# Altium project Keyboard_Second_RevPrjPcb.PrjPcb
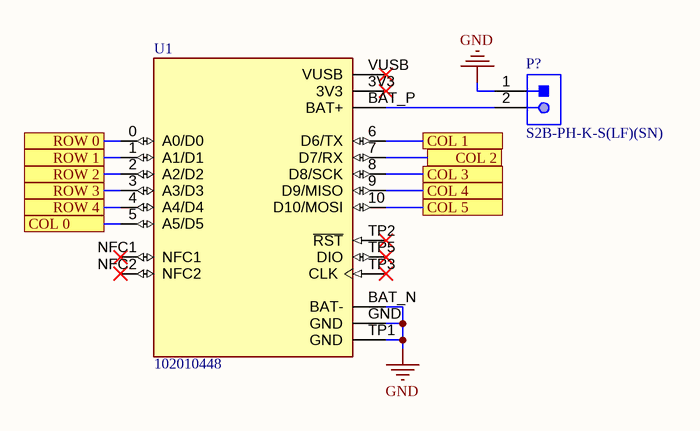
[diagram p0: NRF52840.SchDoc]
CAGE_CODE: ?????; CONTRACT_NUMBER: <CONTRACT NO>; DOC_NO_ASSY_DWG: <ASSY DWG NO>; DOC_NO_BOM: <BOM DOC NO>; DOC_NO_FAB_DWG: <FAB DWG NO>; DOC_NO_SCH_DWG: <SCH DWG NO>; PCB_2_DEC_TOL: +/-.01; PCB_3_DEC_TOL: +/-.010; PCB_ANG_TOL: +/-1/2; PCB_ASSEMBLY_NO: <PCB ASSY NO>; PCB_CHECKER: - -----; PCB_CHECKER_APP_DATE: --/--/----; PCB_DESIGNER: - -----; PCB_DESIGNER_APP_DATE: --/--/----; PCB_DWG_NO: <PCB DWG NO>; PCB_ENGINEER: - -----; PCB_ENGINEER_APP_DATE: --/--/----; PCB_PART_NUMBER: <PCB PN>; PCB_REV: A; SCH_REV: A
2 sheets, 68 parts. Net scope: flat (ports and power ports of the same name join across sheets).
Board file: Motherboard Reversible.PcbDoc
Sheets:
  NRF52840.SchDoc
  Switches.SchDoc

## Sheet NRF52840.SchDoc
size 431 x 279 mm; SheetNumber: 1; SheetTotal: 2; ENG_APP_DATE: --/--/--; DSN_APP_DATE: --/--/--; CHK_APP_DATE: --/--/--

### Parts
P?  S2B-PH-K-S(LF)(SN)  [JST-S2B-PH-K-S_V]
U1  102010448  [MODULE_102010448]

### Ports
COL 0, COL 1, COL 2, COL 3, COL 4, COL 5, ROW 0, ROW 1, ROW 2, ROW 3, ROW 4

### Nets
GND: P?.1 U1.BAT_N(BAT-) U1.GND U1.TP1(GND)
NetD1_1: U1.5(A5/D5) ; port COL 0
NetD2_1: U1.6(D6/TX) ; port COL 1
NetD3_1: U1.7(D7/RX) ; port COL 2
NetD4_1: U1.8(D8/SCK) ; port COL 3
NetD5_1: U1.9(D9/MISO) ; port COL 4
NetD22_1: U1.10(D10/MOSI) ; port COL 5
NetP?_2: P?.2 U1.BAT_P(BAT+)
NetS1_2: U1.0(A0/D0) ; port ROW 0
NetS6_2: U1.1(A1/D1) ; port ROW 1
NetS11_2: U1.2(A2/D2) ; port ROW 2
NetS16_2: U1.3(A3/D3) ; port ROW 3
NetS21_2: U1.4(A4/D4) ; port ROW 4

Not connected (* = marked no-connect by the designer): U1 3V3* NFC1* NFC2* TP2(~{RST})* TP3(CLK)* TP5(DIO)* VUSB*

### Notes on the sheet
- DWG. NO.
- REV.
- SHT.
- THIS DOCUMENT AND THE DATA DISCLOSED HEREIN OR HEREWITH IS THE PROPERTY OF ALTIUM LIMITED AND MAY BE FREELY DISTRIBUTED IN WHOLE. NO RIGHTS ARE RESERVED OR EXPRESS OR IMPLIED WARANTEE GIVEN.
- REVISION
- DESCRIPTION
- DATE
- APPROVED
- ENG:
- APPROVALS
- PROJECT
- DSN:
- CHK:
- REFERENCE DOCUMENTS
- PROJECT REVISION:
- TITLE
- DOCUMENT REVISION:
- DESIGN ITEM:
- BOM:
- FAB DWG:
- PCB DWG:
- ASSY DWG:
- SCALE:
- SIZE
- B
- CAGE CODE
- FILE NAME
- DWG NO.
- SHEET
- OF
- REV

### Library data of the parts
P? = CMP-1755-00004-1: Male Header, Pitch 2 mm, 1 x 2 Position, Height 4.8 mm, Tail Length 3.4 mm, -25 to 85 degC, RoHS, Bulk; Case\Package: Radial; Tolerance: 20%; Capacitance: 10 uF; Voltage Rating (DC): 50 V; Packaging: Bulk; ComponentLink1URL: http://www.jst-mfg.com/product/pdf/eng/ePH.pdf; Radiation Hardening: No; Height: 11 mm; Package Quantity: 200; PackageDescription: Male Header, Pitch 2 mm, 1 x 2 Position, Height 4.8 mm, Tail Length 3.4 mm; PackageReference: S2B-PH-K-S; Diameter: 5 mm; Pins: 2; Mount: Through Hole; Max Operating Temperature: 85 degC; Min Operating Temperature: -40 degC; ComponentLink1Description: Datasheet; DatasheetVersion: Dec-12; Length: 11 mm; Lead Pitch: 2 mm; REACH SVHC: No SVHC; Voltage Rating: 50 V; RoHSCompliant: true
U1 = 102010448: - nRF52840 Transceiver; Bluetooth® 5.x Evaluation Board; MF: Seeed Technology Co., Ltd; SnapEDA_Link: https://www.snapeda.com/parts/102010448/Seeed+Technology+Co.%252C+Ltd/view-part/?ref=snap; Package: None; Value: *; MP: 102010448; Check_prices: https://www.snapeda.com/parts/102010448/Seeed+Technology+Co.%252C+Ltd/view-part/?ref=eda

## Sheet Switches.SchDoc
size A3; SheetNumber: 2; SheetTotal: 2
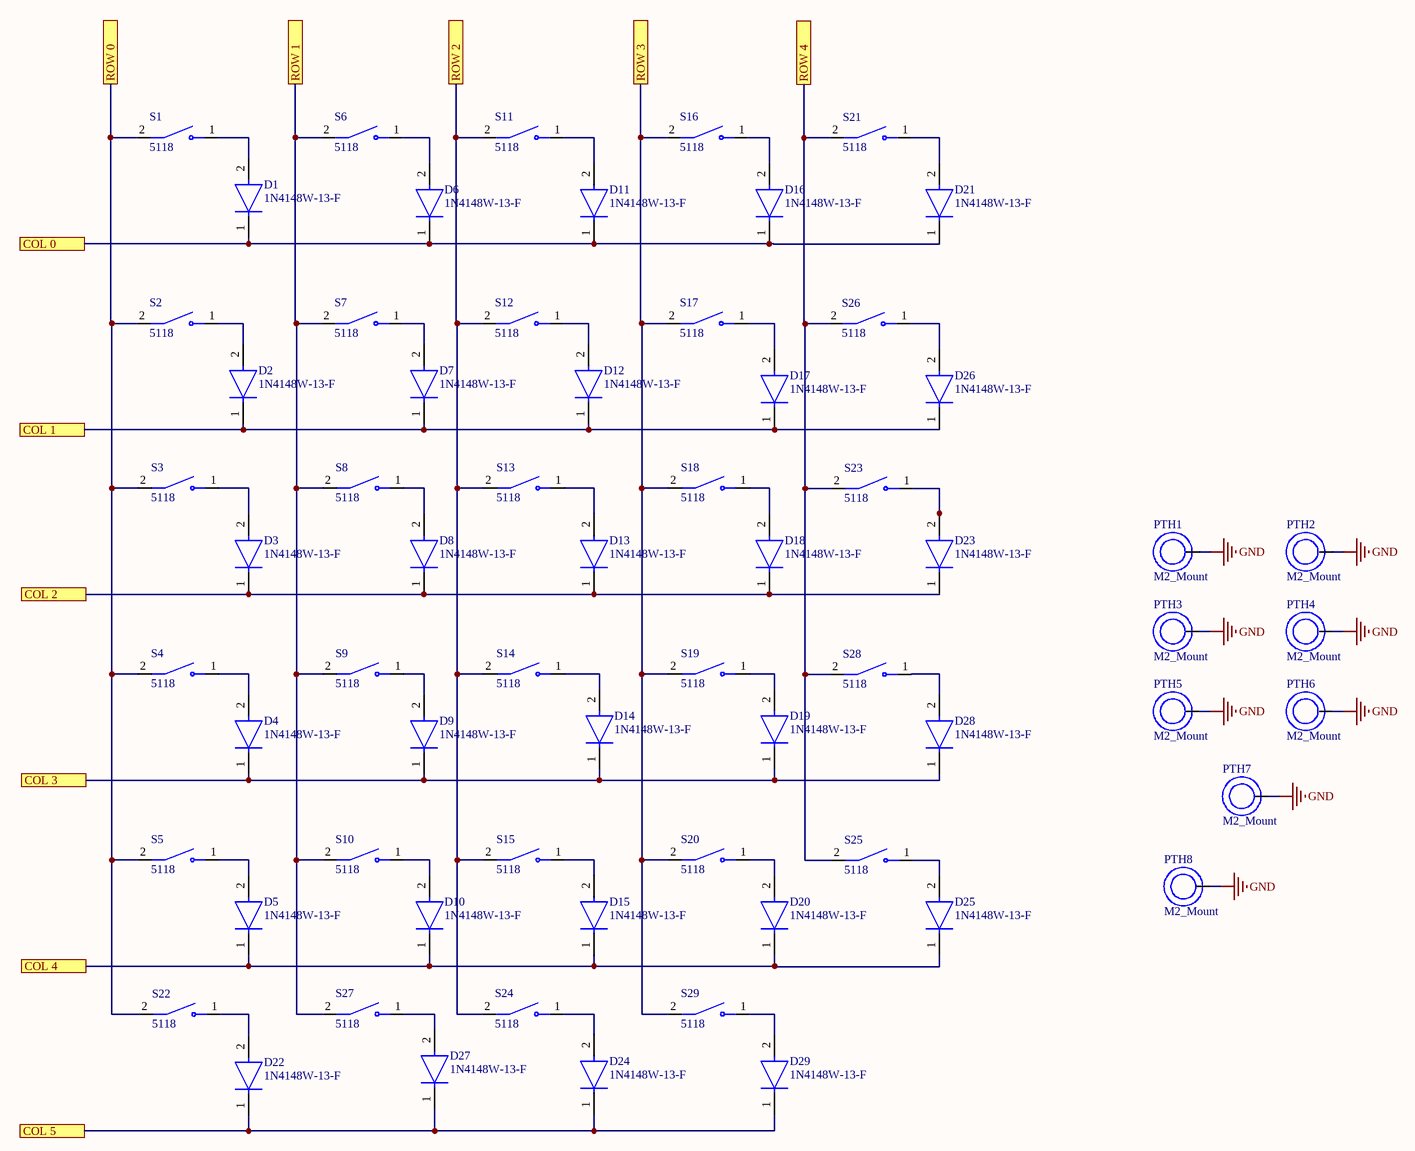
[diagram p1: Switches.SchDoc]

### Parts
D1  1N4148W-13-F  [FP-SOD123-MFG]
D2  1N4148W-13-F  [FP-SOD123-MFG]
D3  1N4148W-13-F  [FP-SOD123-MFG]
D4  1N4148W-13-F  [FP-SOD123-MFG]
D5  1N4148W-13-F  [FP-SOD123-MFG]
D6  1N4148W-13-F  [FP-SOD123-MFG]
D7  1N4148W-13-F  [FP-SOD123-MFG]
D8  1N4148W-13-F  [FP-SOD123-MFG]
D9  1N4148W-13-F  [FP-SOD123-MFG]
D10  1N4148W-13-F  [FP-SOD123-MFG]
D11  1N4148W-13-F  [FP-SOD123-MFG]
D12  1N4148W-13-F  [FP-SOD123-MFG]
D13  1N4148W-13-F  [FP-SOD123-MFG]
D14  1N4148W-13-F  [FP-SOD123-MFG]
D15  1N4148W-13-F  [FP-SOD123-MFG]
D16  1N4148W-13-F  [FP-SOD123-MFG]
D17  1N4148W-13-F  [FP-SOD123-MFG]
D18  1N4148W-13-F  [FP-SOD123-MFG]
D19  1N4148W-13-F  [FP-SOD123-MFG]
D20  1N4148W-13-F  [FP-SOD123-MFG]
D21  1N4148W-13-F  [FP-SOD123-MFG]
D22  1N4148W-13-F  [FP-SOD123-MFG]
D23  1N4148W-13-F  [FP-SOD123-MFG]
D24  1N4148W-13-F  [FP-SOD123-MFG]
D25  1N4148W-13-F  [FP-SOD123-MFG]
D26  1N4148W-13-F  [FP-SOD123-MFG]
D27  1N4148W-13-F  [FP-SOD123-MFG]
D28  1N4148W-13-F  [FP-SOD123-MFG]
D29  1N4148W-13-F  [FP-SOD123-MFG]
PTH1  M2_Mount  [Mounting_Holes]
PTH2  M2_Mount  [Mounting_Holes]
PTH3  M2_Mount  [Mounting_Holes]
PTH4  M2_Mount  [Mounting_Holes]
PTH5  M2_Mount  [Mounting_Holes]
PTH6  M2_Mount  [Mounting_Holes]
PTH7  M2_Mount  [Mounting_Holes]
PTH8  M2_Mount  [Mounting_Holes]
S1  5118  [SW_5118]
S2  5118  [SW_5118]
S3  5118  [SW_5118]
S4  5118  [SW_5118]
S5  5118  [SW_5118]
S6  5118  [SW_5118]
S7  5118  [SW_5118]
S8  5118  [SW_5118]
S9  5118  [SW_5118]
S10  5118  [SW_5118]
S11  5118  [SW_5118]
S12  5118  [SW_5118]
S13  5118  [SW_5118]
S14  5118  [SW_5118]
S15  5118  [SW_5118]
S16  5118  [SW_5118]
S17  5118  [SW_5118]
S18  5118  [SW_5118]
S19  5118  [SW_5118]
S20  5118  [SW_5118]
S21  5118  [SW_5118]
S22  5118  [SW_5118]
S23  5118  [SW_5118]
S24  5118  [SW_5118]
S25  5118  [SW_5118]
S26  5118  [SW_5118]
S27  5118  [SW_5118]
S28  5118  [SW_5118]
S29  5118  [SW_5118]

### Ports
COL 0, COL 1, COL 2, COL 3, COL 4, COL 5, ROW 0, ROW 1, ROW 2, ROW 3, ROW 4

### Nets
GND: PTH1.0 PTH2.0 PTH3.0 PTH4.0 PTH5.0 PTH6.0 PTH7.0 PTH8.0
NetD1_1: D1.1(C) D6.1(C) D11.1(C) D16.1(C) D21.1(C) ; port COL 0
NetD1_2: D1.2(A) S1.1(NO)
NetD2_1: D2.1(C) D7.1(C) D12.1(C) D17.1(C) D26.1(C) ; port COL 1
NetD2_2: D2.2(A) S2.1(NO)
NetD3_1: D3.1(C) D8.1(C) D13.1(C) D18.1(C) D23.1(C) ; port COL 2
NetD3_2: D3.2(A) S3.1(NO)
NetD4_1: D4.1(C) D9.1(C) D14.1(C) D19.1(C) D28.1(C) ; port COL 3
NetD4_2: D4.2(A) S4.1(NO)
NetD5_1: D5.1(C) D10.1(C) D15.1(C) D20.1(C) D25.1(C) ; port COL 4
NetD5_2: D5.2(A) S5.1(NO)
NetD6_2: D6.2(A) S6.1(NO)
NetD7_2: D7.2(A) S7.1(NO)
NetD8_2: D8.2(A) S8.1(NO)
NetD9_2: D9.2(A) S9.1(NO)
NetD10_2: D10.2(A) S10.1(NO)
NetD11_2: D11.2(A) S11.1(NO)
NetD12_2: D12.2(A) S12.1(NO)
NetD13_2: D13.2(A) S13.1(NO)
NetD14_2: D14.2(A) S14.1(NO)
NetD15_2: D15.2(A) S15.1(NO)
NetD16_2: D16.2(A) S16.1(NO)
NetD17_2: D17.2(A) S17.1(NO)
NetD18_2: D18.2(A) S18.1(NO)
NetD19_2: D19.2(A) S19.1(NO)
NetD20_2: D20.2(A) S20.1(NO)
NetD21_2: D21.2(A) S21.1(NO)
NetD22_1: D22.1(C) D24.1(C) D27.1(C) D29.1(C) ; port COL 5
NetD22_2: D22.2(A) S22.1(NO)
NetD23_2: D23.2(A) S23.1(NO)
NetD24_2: D24.2(A) S24.1(NO)
NetD25_2: D25.2(A) S25.1(NO)
NetD26_2: D26.2(A) S26.1(NO)
NetD27_2: D27.2(A) S27.1(NO)
NetD28_2: D28.2(A) S28.1(NO)
NetD29_2: D29.2(A) S29.1(NO)
NetS1_2: S1.2(COM) S2.2(COM) S3.2(COM) S4.2(COM) S5.2(COM) S22.2(COM) ; port ROW 0
NetS6_2: S6.2(COM) S7.2(COM) S8.2(COM) S9.2(COM) S10.2(COM) S27.2(COM) ; port ROW 1
NetS11_2: S11.2(COM) S12.2(COM) S13.2(COM) S14.2(COM) S15.2(COM) S24.2(COM) ; port ROW 2
NetS16_2: S16.2(COM) S17.2(COM) S18.2(COM) S19.2(COM) S20.2(COM) S29.2(COM) ; port ROW 3
NetS21_2: S21.2(COM) S23.2(COM) S25.2(COM) S26.2(COM) S28.2(COM) ; port ROW 4

### Library data of the parts
D1-D29 = CMP-12791-000005-1: DIODE GEN PURP 100V 150MA SOD123; Manufacturer: Diodes Inc.; Capacitance: 2pF; Forward Current: 300mA; Max Junction Temp: +150°C; Value: 2pF; Standoff Height: 0mm; Peak Reverse Current: 1uA; Max Surge Forward Current: 1A; Category: Diode; Height: 1.45mm; ComponentLink2URL: https://upverter.com/datasheet/628e7d6fee5901eee6eef4567d1c3569f2cd3cde.pdf; Lead Free: Yes; ComponentLink2Description: Datasheet; Octopart: https://octopart.com/1n4148w-13-f-diodes+inc.-2359612; Temperature Range High: +150°C; Device Class L2: Diodes; Digikey Description: DIODE GEN PURP 100V 150MA SOD123; Reverse Voltage: 100V; Temperature Range Low: -65°C; Device Class L1: Discrete Semiconductors; Package: SOD123; RoHS: TRUE; Manufacturer Part Number: 1N4148W-13-F; Footprint Url: https://www.diodes.com/assets/Package-Files/SOD123.pdf; Automotive: No; Max Repetitive Reverse Voltage: 100V; Mouser Description: 1N4148W Series 2 A 100 V 400 mW Surface Mount Fast Switching Diode - SOD-123; Temperature: -65°C to +150°C; Device Class L3: Rectifier Diodes
S1-S29 = 5118: SWITCH SKT FOR KAILH CHOC 1=10PC; MF: Adafruit Industries LLC; SnapEDA_Link: https://www.snapeda.com/parts/5118/Adafruit+Industries/view-part/?ref=snap; Package: NON STANDARD-2 Adafruit; Value: *; MP: 5118; Check_prices: https://www.snapeda.com/parts/5118/Adafruit+Industries/view-part/?ref=eda

## Nets that join several sheets
GND: NRF52840 (P?.1 U1.BAT_N U1.GND U1.TP1), Switches (8 pins)
NetD1_1: NRF52840 (U1.5), Switches (5 pins)
NetD2_1: NRF52840 (U1.6), Switches (5 pins)
NetD3_1: NRF52840 (U1.7), Switches (5 pins)
NetD4_1: NRF52840 (U1.8), Switches (5 pins)
NetD5_1: NRF52840 (U1.9), Switches (5 pins)
NetD22_1: NRF52840 (U1.10), Switches (D22.1 D24.1 D27.1 D29.1)
NetS1_2: NRF52840 (U1.0), Switches (6 pins)
NetS6_2: NRF52840 (U1.1), Switches (6 pins)
NetS11_2: NRF52840 (U1.2), Switches (6 pins)
NetS16_2: NRF52840 (U1.3), Switches (6 pins)
NetS21_2: NRF52840 (U1.4), Switches (5 pins)